# Altium project STM8L101-N20-EVAL.PrjPcb
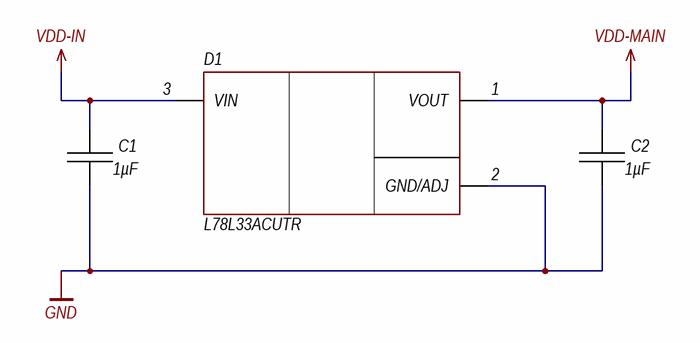
[diagram p0: PowerSupply.SchDoc]
ProjectTitle: Project description; ProjectShortDate: 2021.10; ProjectRevision: 0.1.1; ProjectNumber: STM8L101-N20-EVAL; ProjectDate: 12.10.2021; ProjectCompanyName: Azek Clark © 2020; ProjectAuthor: Clark A.
7 sheets, 40 parts. Net scope: flat (ports and power ports of the same name join across sheets).
Board file: PCB.PcbDoc
Sheets:
  PowerSupply.SchDoc
  MCU.SchDoc
  MCU-Debug.SchDoc
  Connector-side-1.SchDoc
  Connector-side-2.SchDoc
  Button-LED.SchDoc
  Power-LED.SchDoc

## Sheet PowerSupply.SchDoc: =ProjectTitle
size 297 x 209 mm; Author: Clark A.; CompanyName: Azek Clark © 2020; Address1: Address1; Address2: Address2; Address3: Address3; Address4: Address4; DocumentNumber: STM8L101-N20-EVAL 0.1.1; SheetNumber: 1; SheetTotal: 7; Scale: 1:1; DocumentType: Схема электрическая принципиальная; FirstReferrence: STM8L101-N20-EVAL

### Parts
C1  1µF  [CH0603CM]
C2  1µF  [CH0603CM]
D1  L78L33ACUTR  [SOT89_123]

### Nets
GND: C1.1 C2.1 D1.2(GND/ADJ)
VDD-IN: C1.2 D1.3(VIN)
VDD-MAIN: C2.2 D1.1(VOUT)

### Notes on the sheet
- Утв.
- Н.контр.
- Т.контр.
- Пров.
- Разраб.
- Изм.
- Лист
- № докум.
- Подп.
- Дата
- Копировал
- Формат А4
- Лит.
- Листов
- Масса
- Масштаб

### Library data of the parts
C1 C2 = Capacitor: Manufacturer: *; Model: *; HelpURL: *; ComponentKind: *; Value: 1µF
D1 = L78LxxACUTR: LDO; Manufacturer: ST Microelectronics; Model: L78L33ACUTR; HelpURL: https://www.st.com/resource/en/datasheet/l78l.pdf; ComponentKind: SOT-89, 100mA

## Sheet MCU.SchDoc: =ProjectTitle
size 297 x 209 mm; Author: Clark A.; CompanyName: Azek Clark © 2020; Address1: Address1; Address2: Address2; Address3: Address3; Address4: Address4; DocumentNumber: STM8L101-N20-EVAL 0.1.1; SheetNumber: 2; SheetTotal: 7; Scale: 1:1; DocumentType: Схема электрическая принципиальная; FirstReferrence: STM8L101-N20-EVAL
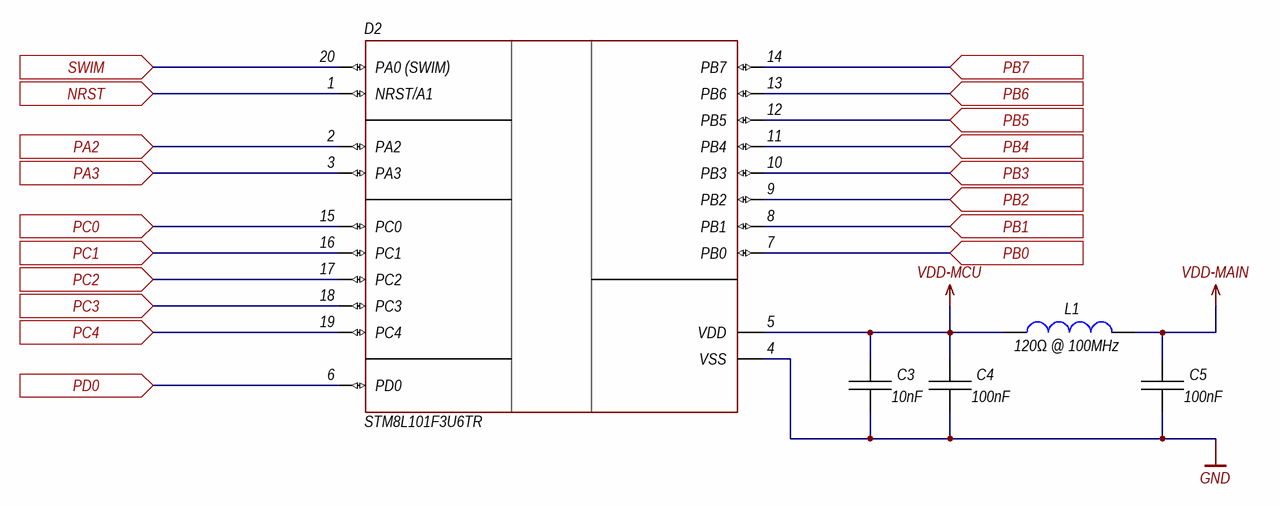
[diagram p1: MCU.SchDoc]

### Parts
C3  10nF  [CH0402C]
C4  100nF  [CH0402C]
C5  100nF  [CH0402C]
D2  STM8L101F3U6TR  [20-UFQFPN]
L1  120Ω @ 100MHz  [CH0402L]

### Ports
NRST (in), PA2 (in), PA3 (in), PB0 (in), PB1 (in), PB2 (in), PB3 (in), PB4 (in), PB5 (in), PB6 (in), PB7 (in), PC0 (in), PC1 (in), PC2 (in), PC3 (in), PC4 (in), PD0 (in), SWIM (in)

### Nets
GND: C3.1 C4.1 C5.1 D2.4(VSS)
VDD-MAIN: C5.2 L1.1
VDD-MCU: C3.2 C4.2 D2.5(VDD) L1.2
NRST: D2.1(NRST/A1) ; port NRST
PA2: D2.2(PA2) ; port PA2
PA3: D2.3(PA3) ; port PA3
PB0: D2.7(PB0) ; port PB0
PB1: D2.8(PB1) ; port PB1
PB2: D2.9(PB2) ; port PB2
PB3: D2.10(PB3) ; port PB3
PB4: D2.11(PB4) ; port PB4
PB5: D2.12(PB5) ; port PB5
PB6: D2.13(PB6) ; port PB6
PB7: D2.14(PB7) ; port PB7
PC0: D2.15(PC0) ; port PC0
PC1: D2.16(PC1) ; port PC1
PC2: D2.17(PC2) ; port PC2
PC3: D2.18(PC3) ; port PC3
PC4: D2.19(PC4) ; port PC4
PD0: D2.6(PD0) ; port PD0
SWIM: D2.20(PA0_(SWIM)) ; port SWIM

### Notes on the sheet
- Изм.
- Лист
- № докум.
- Подп.
- Дата
- Копировал
- Формат А4

### Library data of the parts
C3-C5 = Capacitor: Manufacturer: *; Model: *; HelpURL: *; ComponentKind: *
  C3: Value: 10nF
  C4 C5: Value: 100nF
D2 = STM8L101F3U6: STM8; Manufacturer: ST Microelectronics; Model: STM8L101F3U6TR; ComponentKind: UFQFPN20, 1.65-3.6V, 16MHz, 1.5Kb RAM, 2Kb Flash; HelpURL: https://lcsc.com/product-detail/ST-Microelectronics_STMicroelectronics-STM8L101F3U6TR_C111168.html
L1 = Inductor: Manufacturer: *; Model: *; HelpURL: *; ComponentKind: *; Value: 120Ω @ 100MHz

## Sheet MCU-Debug.SchDoc: =ProjectTitle
size 297 x 209 mm; Author: Clark A.; CompanyName: Azek Clark © 2020; Address1: Address1; Address2: Address2; Address3: Address3; Address4: Address4; DocumentNumber: STM8L101-N20-EVAL 0.1.1; SheetNumber: 3; SheetTotal: 7; Scale: 1:1; DocumentType: Схема электрическая принципиальная; FirstReferrence: STM8L101-N20-EVAL
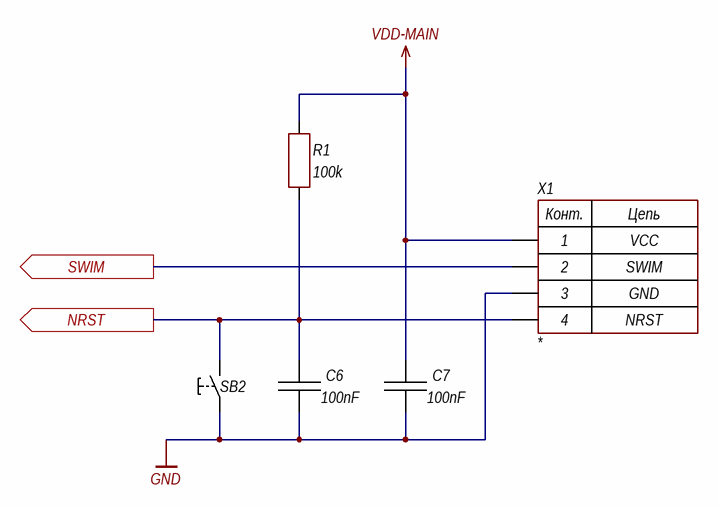
[diagram p2: MCU-Debug.SchDoc]

### Parts
C6  100nF  [CH0402C]
C7  100nF  [CH0402C]
R1  100k  [CH0402R]
SB2  "Кнопка"  [BUT: YTS-A017]  (value not drawn)
X1  *  [CON: PLS-4]

### Ports
NRST (out), SWIM (out)

### Nets
GND: C6.1 C7.1 SB2.1 X1.3
VDD-MAIN: C7.2 R1.2 X1.1
NRST: C6.2 R1.1 SB2.2 X1.4 ; port NRST
SWIM: X1.2 ; port SWIM

### Notes on the sheet
- VCC
- SWIM
- GND
- NRST
- Изм.
- Лист
- № докум.
- Подп.
- Дата
- Копировал
- Формат А4
- (in symbol 4-Connector) Конт.; Цепь

### Library data of the parts
C6 C7 = Capacitor: Manufacturer: *; Model: *; HelpURL: *; ComponentKind: *; Value: 100nF
R1 = Resistor: Manufacturer: *; Model: *; HelpURL: *; ComponentKind: *; Value: 100k
SB2 = 1-Button: Button, no latching; Manufacturer: *; Model: *; HelpURL: *; ComponentKind: *
X1 = 4-Connector: Model: *; Manufacturer: *; HelpURL: *; ComponentKind: *

## Sheet Connector-side-1.SchDoc: =ProjectTitle
size 297 x 209 mm; Author: Clark A.; CompanyName: Azek Clark © 2020; Address1: Address1; Address2: Address2; Address3: Address3; Address4: Address4; DocumentNumber: STM8L101-N20-EVAL 0.1.1; SheetNumber: 4; SheetTotal: 7; Scale: 1:1; DocumentType: Схема электрическая принципиальная; FirstReferrence: STM8L101-N20-EVAL
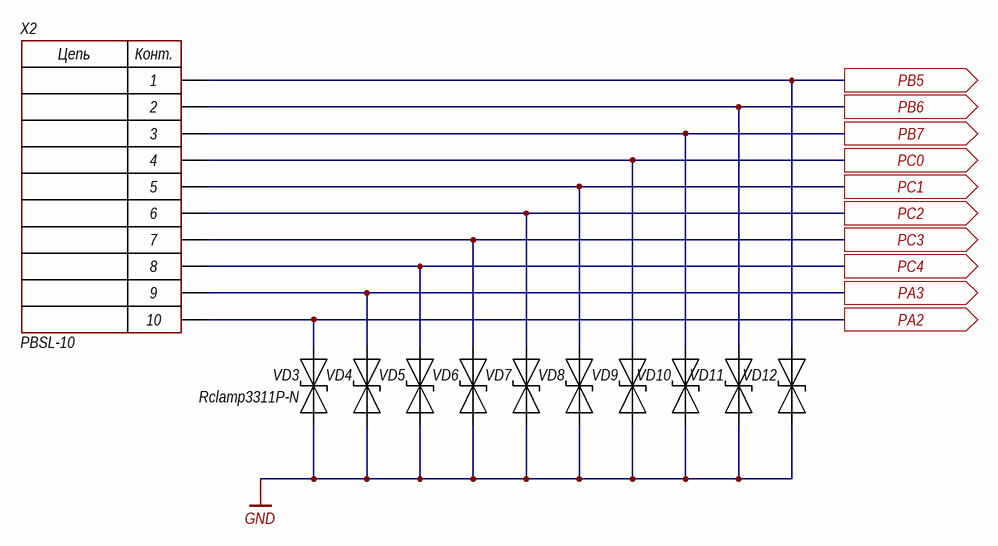
[diagram p3: Connector-side-1.SchDoc]

### Parts
VD3  Rclamp3311P-N  [DFN1006-2]
VD4  Rclamp3311P-N  [DFN1006-2]  (value not drawn)
VD5  Rclamp3311P-N  [DFN1006-2]  (value not drawn)
VD6  Rclamp3311P-N  [DFN1006-2]  (value not drawn)
VD7  Rclamp3311P-N  [DFN1006-2]  (value not drawn)
VD8  Rclamp3311P-N  [DFN1006-2]  (value not drawn)
VD9  Rclamp3311P-N  [DFN1006-2]  (value not drawn)
VD10  Rclamp3311P-N  [DFN1006-2]  (value not drawn)
VD11  Rclamp3311P-N  [DFN1006-2]  (value not drawn)
VD12  Rclamp3311P-N  [DFN1006-2]  (value not drawn)
X2  PBSL-10  [CON: PBSL-10]

### Ports
PA2 (out), PA3 (out), PB5 (out), PB6 (out), PB7 (out), PC0 (out), PC1 (out), PC2 (out), PC3 (out), PC4 (out)

### Nets
GND: VD3.1(A) VD4.1(A) VD5.1(A) VD6.1(A) VD7.1(A) VD8.1(A) VD9.1(A) VD10.1(A) VD11.1(A) VD12.1(A)
PA2: VD3.2(C) X2.10 ; port PA2
PA3: VD4.2(C) X2.9 ; port PA3
PB5: VD12.2(C) X2.1 ; port PB5
PB6: VD11.2(C) X2.2 ; port PB6
PB7: VD10.2(C) X2.3 ; port PB7
PC0: VD9.2(C) X2.4 ; port PC0
PC1: VD8.2(C) X2.5 ; port PC1
PC2: VD7.2(C) X2.6 ; port PC2
PC3: VD6.2(C) X2.7 ; port PC3
PC4: VD5.2(C) X2.8 ; port PC4

### Notes on the sheet
- Изм.
- Лист
- № докум.
- Подп.
- Дата
- Копировал
- Формат А4
- (in symbol 10-Connector) Цепь; Конт.

### Library data of the parts
VD3-VD12 = TVS-diod: Manufacturer: BORN; ComponentKind: 3.3V, 8V. 10A; Model: Rclamp3311P-N; HelpURL: https://www.lcsc.com/product-detail/ESD-Protection-Devices_BORN-Rclamp3311P-N_C406234.html
X2 = 10-Connector: Model: PBSL-10; Manufacturer: *; HelpURL: *; ComponentKind: *

## Sheet Connector-side-2.SchDoc: =ProjectTitle
size 297 x 209 mm; Author: Clark A.; CompanyName: Azek Clark © 2020; Address1: Address1; Address2: Address2; Address3: Address3; Address4: Address4; DocumentNumber: STM8L101-N20-EVAL 0.1.1; SheetNumber: 5; SheetTotal: 7; Scale: 1:1; DocumentType: Схема электрическая принципиальная; FirstReferrence: STM8L101-N20-EVAL
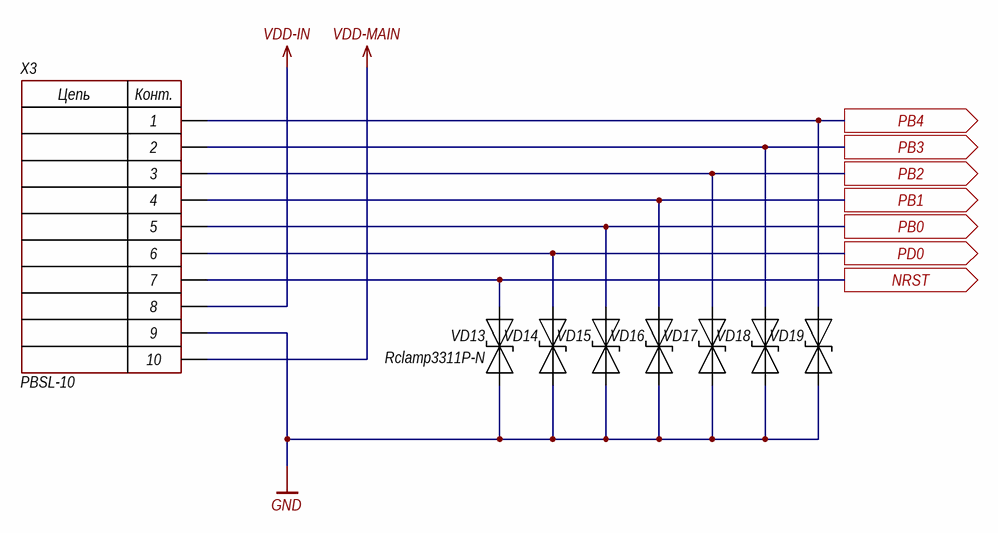
[diagram p4: Connector-side-2.SchDoc]

### Parts
VD13  Rclamp3311P-N  [DFN1006-2]
VD14  Rclamp3311P-N  [DFN1006-2]  (value not drawn)
VD15  Rclamp3311P-N  [DFN1006-2]  (value not drawn)
VD16  Rclamp3311P-N  [DFN1006-2]  (value not drawn)
VD17  Rclamp3311P-N  [DFN1006-2]  (value not drawn)
VD18  Rclamp3311P-N  [DFN1006-2]  (value not drawn)
VD19  Rclamp3311P-N  [DFN1006-2]  (value not drawn)
X3  PBSL-10  [CON: PBSL-10]

### Ports
NRST (out), PB0 (out), PB1 (out), PB2 (out), PB3 (out), PB4 (out), PD0 (out)

### Nets
GND: VD13.1(A) VD14.1(A) VD15.1(A) VD16.1(A) VD17.1(A) VD18.1(A) VD19.1(A) X3.9
VDD-IN: X3.8
VDD-MAIN: X3.10
NRST: VD13.2(C) X3.7 ; port NRST
PB0: VD15.2(C) X3.5 ; port PB0
PB1: VD16.2(C) X3.4 ; port PB1
PB2: VD17.2(C) X3.3 ; port PB2
PB3: VD18.2(C) X3.2 ; port PB3
PB4: VD19.2(C) X3.1 ; port PB4
PD0: VD14.2(C) X3.6 ; port PD0

### Notes on the sheet
- Изм.
- Лист
- № докум.
- Подп.
- Дата
- Копировал
- Формат А4
- (in symbol 10-Connector) Цепь; Конт.

### Library data of the parts
VD13-VD19 = TVS-diod: Manufacturer: BORN; ComponentKind: 3.3V, 8V. 10A; Model: Rclamp3311P-N; HelpURL: https://www.lcsc.com/product-detail/ESD-Protection-Devices_BORN-Rclamp3311P-N_C406234.html
X3 = 10-Connector: Model: PBSL-10; Manufacturer: *; HelpURL: *; ComponentKind: *

## Sheet Button-LED.SchDoc: =ProjectTitle
size 297 x 209 mm; Author: Clark A.; CompanyName: Azek Clark © 2020; Address1: Address1; Address2: Address2; Address3: Address3; Address4: Address4; DocumentNumber: STM8L101-N20-EVAL 0.1.1; SheetNumber: 6; SheetTotal: 7; Scale: 1:1; DocumentType: Схема электрическая принципиальная; FirstReferrence: STM8L101-N20-EVAL
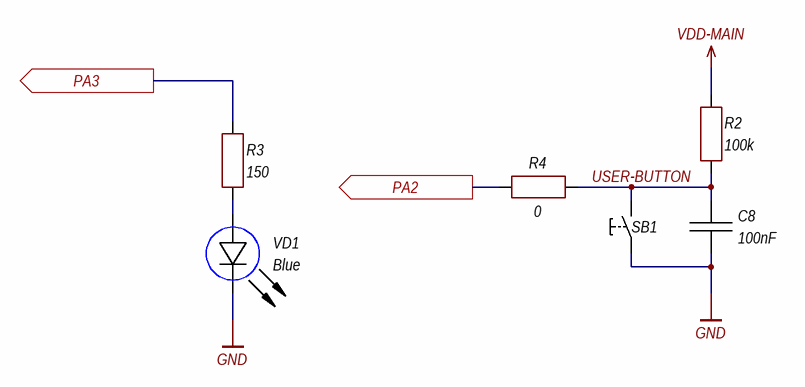
[diagram p5: Button-LED.SchDoc]

### Parts
C8  100nF  [CH0402C]
R2  100k  [CH0402R]
R3  150  [CH0402R]
R4  0  [CH0402R]
SB1  "Кнопка"  [BUT: YTS-A017]  (value not drawn)
VD1  Blue  [CH0402LG]

### Ports
PA2 (out), PA3 (out)

### Nets
GND: C8.1 SB1.1 VD1.2(C)
VDD-MAIN: R2.2
PA2: R4.1 ; port PA2
PA3: R3.2 ; port PA3
USER-BUTTON: C8.2 R2.1 R4.2 SB1.2
NetR3_1: R3.1 VD1.1(A)

### Notes on the sheet
- Изм.
- Лист
- № докум.
- Подп.
- Дата
- Копировал
- Формат А4

### Library data of the parts
C8 = Capacitor: Manufacturer: *; Model: *; HelpURL: *; ComponentKind: *; Value: 100nF
R2-R4 = Resistor: Manufacturer: *; Model: *; HelpURL: *; ComponentKind: *
  R2: Value: 100k
  R3: Value: 150
  R4: Value: 0
SB1 = 1-Button: Button, no latching; Manufacturer: *; Model: *; HelpURL: *; ComponentKind: *
VD1 = LED: Manufacturer: *; Model: *; HelpURL: *; ComponentKind: *; Value: Blue

## Sheet Power-LED.SchDoc: =ProjectTitle
size 297 x 209 mm; Author: Clark A.; CompanyName: Azek Clark © 2020; Address1: Address1; Address2: Address2; Address3: Address3; Address4: Address4; DocumentNumber: STM8L101-N20-EVAL 0.1.1; SheetNumber: 7; SheetTotal: 7; Scale: 1:1; DocumentType: Схема электрическая принципиальная; FirstReferrence: STM8L101-N20-EVAL
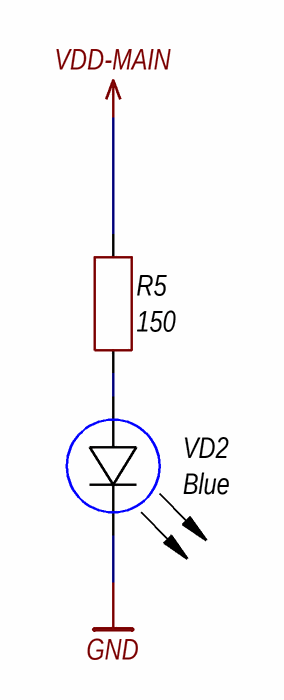
[diagram p6: Power-LED.SchDoc]

### Parts
R5  150  [CH0402R]
VD2  Blue  [CH0402LG]

### Nets
GND: VD2.2(C)
VDD-MAIN: R5.2
NetR5_1: R5.1 VD2.1(A)

### Notes on the sheet
- Изм.
- Лист
- № докум.
- Подп.
- Дата
- Копировал
- Формат А4

### Library data of the parts
R5 = Resistor: Manufacturer: *; Model: *; HelpURL: *; ComponentKind: *; Value: 150
VD2 = LED: Manufacturer: *; Model: *; HelpURL: *; ComponentKind: *; Value: Blue

## Nets that join several sheets
GND: PowerSupply (C1.1 C2.1 D1.2), MCU (C3.1 C4.1 C5.1 D2.4), MCU-Debug (C6.1 C7.1 SB2.1 X1.3), Connector-side-1 (10 pins), Connector-side-2 (8 pins), Button-LED (C8.1 SB1.1 VD1.2), Power-LED (VD2.2)
VDD-IN: PowerSupply (C1.2 D1.3), Connector-side-2 (X3.8)
VDD-MAIN: PowerSupply (C2.2 D1.1), MCU (C5.2 L1.1), MCU-Debug (C7.2 R1.2 X1.1), Connector-side-2 (X3.10), Button-LED (R2.2), Power-LED (R5.2)
NRST: MCU (D2.1), MCU-Debug (C6.2 R1.1 SB2.2 X1.4), Connector-side-2 (VD13.2 X3.7)
PA2: MCU (D2.2), Connector-side-1 (VD3.2 X2.10), Button-LED (R4.1)
PA3: MCU (D2.3), Connector-side-1 (VD4.2 X2.9), Button-LED (R3.2)
PB0: MCU (D2.7), Connector-side-2 (VD15.2 X3.5)
PB1: MCU (D2.8), Connector-side-2 (VD16.2 X3.4)
PB2: MCU (D2.9), Connector-side-2 (VD17.2 X3.3)
PB3: MCU (D2.10), Connector-side-2 (VD18.2 X3.2)
PB4: MCU (D2.11), Connector-side-2 (VD19.2 X3.1)
PB5: MCU (D2.12), Connector-side-1 (VD12.2 X2.1)
PB6: MCU (D2.13), Connector-side-1 (VD11.2 X2.2)
PB7: MCU (D2.14), Connector-side-1 (VD10.2 X2.3)
PC0: MCU (D2.15), Connector-side-1 (VD9.2 X2.4)
PC1: MCU (D2.16), Connector-side-1 (VD8.2 X2.5)
PC2: MCU (D2.17), Connector-side-1 (VD7.2 X2.6)
PC3: MCU (D2.18), Connector-side-1 (VD6.2 X2.7)
PC4: MCU (D2.19), Connector-side-1 (VD5.2 X2.8)
PD0: MCU (D2.6), Connector-side-2 (VD14.2 X3.6)
SWIM: MCU (D2.20), MCU-Debug (X1.2)